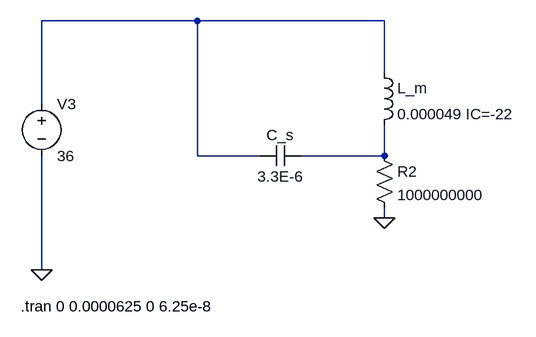
[diagram p0: schematic RegenerativeSnubbe.asc]
RegenerativeSnubbe.asc, the LTspice schematic file:
Version 4
SHEET 1 880 680
WIRE -240 -64 -480 -64
WIRE 48 -64 -240 -64
WIRE 48 16 48 -64
WIRE -480 64 -480 -64
WIRE -240 144 -240 -64
WIRE -144 144 -240 144
WIRE 48 144 48 96
WIRE 48 144 -80 144
WIRE 48 240 48 224
WIRE -480 320 -480 144
FLAG -480 320 0
FLAG 48 240 0
SYMBOL ind 32 0 R0
SYMATTR InstName L_m
SYMATTR Value 0.000049 IC=-22
SYMBOL cap -80 128 R90
WINDOW 0 0 32 VBottom 2
WINDOW 3 32 32 VTop 2
SYMATTR InstName C_s
SYMATTR Value 3.3E-6
SYMBOL voltage -480 48 R0
WINDOW 123 0 0 Left 0
WINDOW 39 0 0 Left 0
SYMATTR InstName V3
SYMATTR Value 36
SYMBOL res 32 128 R0
SYMATTR InstName R2
SYMATTR Value 1000000000
TEXT -512 376 Left 2 !.tran 0 0.0000625 0 6.25e-8

The netlist it stands for:
* RegenerativeSnubbe.asc
L_m N001 N002 0.000049 IC=-22
C_s N002 N001 3.3E-6
V3 N001 0 36
R2 N002 0 1000000000
.tran 0 0.0000625 0 6.25e-8
.backanno
.end